# Altium schematic sheet 05_SiC_Nanosecond_Stage.SchDoc
size A4; SheetNumber: 5; SheetTotal: 6
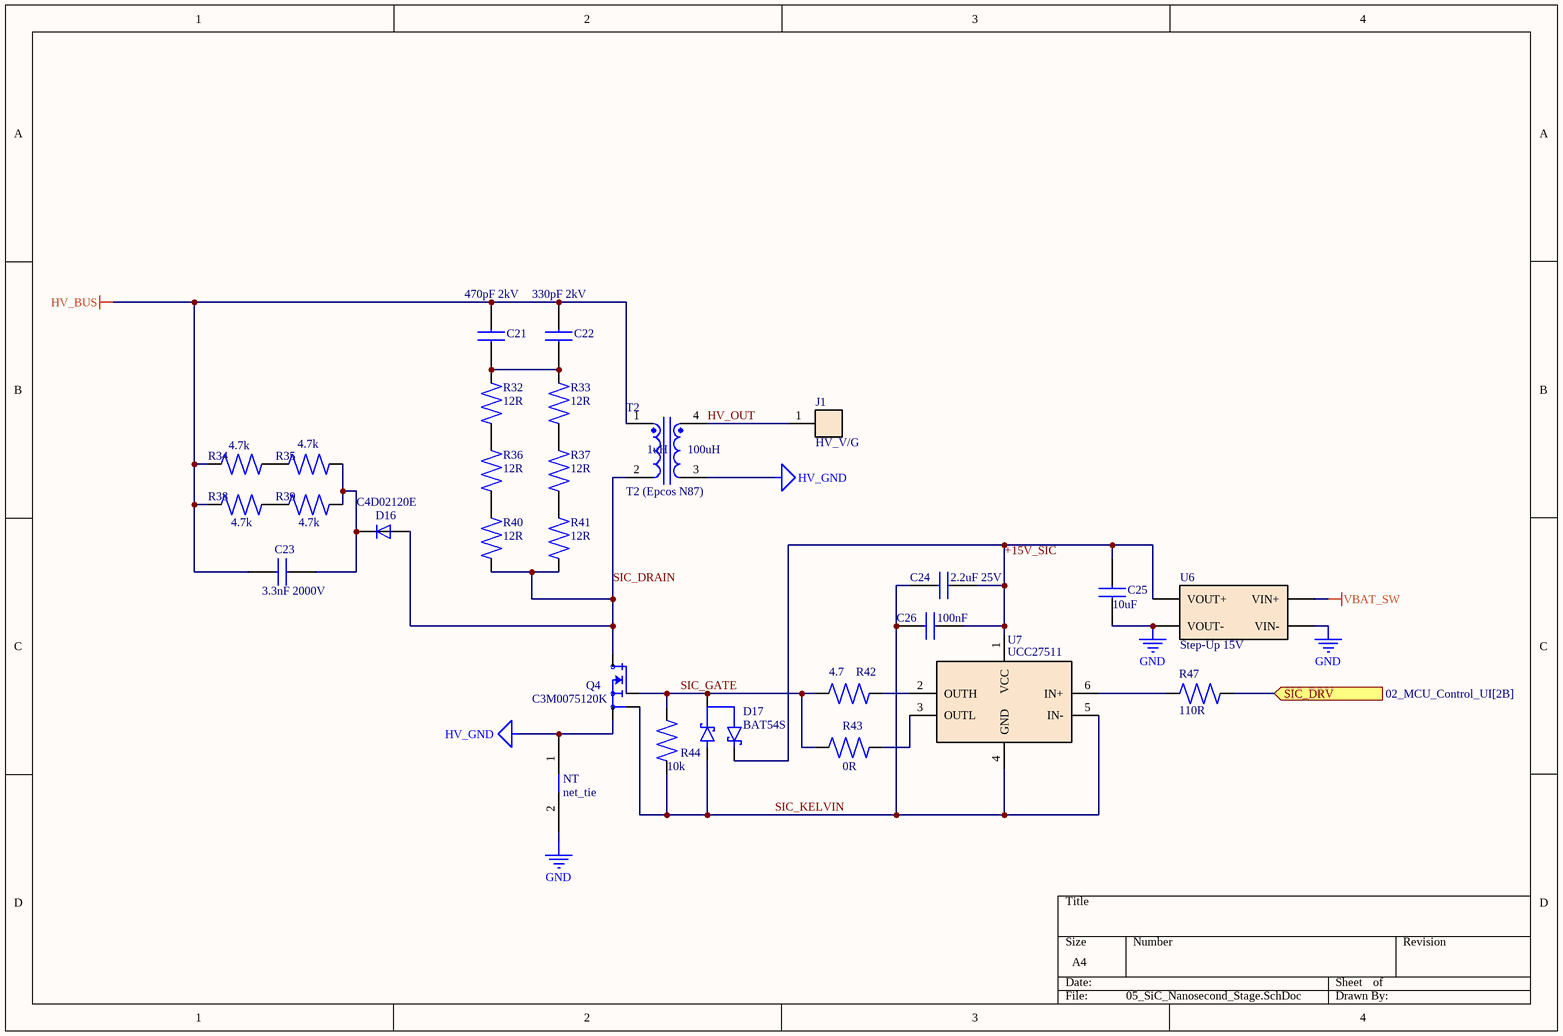
[diagram p0: 05_SiC_Nanosecond_Stage.SchDoc]

## Parts
C21  470pF 2kV  [CAP_FILM_P15.0_CBB81_HEAVY_DUTY]
C22  330pF 2kV  [CAP_FILM_P15.0_CBB81_HEAVY_DUTY]
C23  3.3nF 2000V  [CAP_FILM_P15.0_CBB81_HEAVY_DUTY]
C24  2.2uF 25V  [CHIP_0805_SMD]
C25  10uF  [CHIP_0805_SMD]
C26  100nF  [CHIP_0603_SMD]
D16  C4D02120E  [TO-252-2L_DPAK_THERMAL]
D17  BAT54S  [SOT-23_3P_SMD]
J1  HV_V/G  [PAD_HV_UL3239_28AWG_ROUND]
NT  net_tie  [NET_TIE_SMD]  (net tie, no BOM)
Q4  C3M0075120K  [TO-247-4_WOLFSPEED_SLOTTED_VERT]
R32  12R  [RES_2512_6.3x3.2_HANDSOLDER]
R33  12R  [RES_2512_6.3x3.2_HANDSOLDER]
R34  4.7k  [CHIP_1206_SMD]
R35  4.7k  [CHIP_1206_SMD]
R36  12R  [RES_2512_6.3x3.2_HANDSOLDER]
R37  12R  [RES_2512_6.3x3.2_HANDSOLDER]
R38  4.7k  [CHIP_1206_SMD]
R39  4.7k  [CHIP_1206_SMD]
R40  12R  [RES_2512_6.3x3.2_HANDSOLDER]
R41  12R  [RES_2512_6.3x3.2_HANDSOLDER]
R42  4.7  [CHIP_0603_SMD]
R43  0R  [CHIP_1206_SMD]
R44  10k  [CHIP_0603_SMD]
R47  110R  [CHIP_0805_SMD]
T2  T2 (Epcos N87)  [TRANS_AUTOTRANS_T2_EPCOS_R20_N87]
U6  Step-Up 15V  [MODULE_DC-DC_MT3608_BOOST_THT]
U7  UCC27511  [SOT-23-6_DBV_HANDSOLDER]

## Ports
SIC_DRV (in, see 02_MCU_Control_UI[2B])

## Nets
GND: C25.1 NT.2 U6.2(VIN-) U6.4(VOUT-)
HV_BUS: C21.2 C22.2 C23.1 R34.1 R38.1 T2.1(+850V)
HV_GND: NT.1 Q4.2(S) T2.3(HV_GND)
VBAT_SW: U6.1(VIN+)
+15V_SIC: C24.1 C25.2 C26.1 D17.2(K2) U6.3(VOUT+) U7.1(VCC)
HV_OUT: J1.1 T2.4(SEC+)
SIC_DRAIN: D16.1(A) Q4.1(D) R40.1 R41.1 T2.2(DRAIN)
SIC_DRV: R47.2 ; port SIC_DRV
SIC_GATE: D17.3(K1+A2) Q4.4(G) R42.1 R43.1 R44.2
SIC_KELVIN: C24.2 C26.2 D17.1(A1) Q4.3(KS) R44.1 U7.4(GND) U7.5(IN-)
NetC21_1: C21.1 C22.1 R32.2 R33.2
NetC23_2: C23.2 D16.2(K) R35.2 R39.2
NetR32_1: R32.1 R36.2
NetR33_1: R33.1 R37.2
NetR34_2: R34.2 R35.1
NetR36_1: R36.1 R40.2
NetR37_1: R37.1 R41.2
NetR38_2: R38.2 R39.1
NetR42_2: R42.2 U7.2(OUTH)
NetR43_2: R43.2 U7.3(OUTL)
NetR47_1: R47.1 U7.6(IN+)

## Notes on the sheet
- (in symbol TRANS_AUTOTRANS_T2_N87) 1uH; 100uH

## Library data of the parts
C21 = CAP_FILM_CBB81_470pF_2000V: Capacitor Film, Polypropylene (PP), 470 pF, 2000 VDC, ±5%, Radial THT, Pitch 15mm, CBB81
C22 = CAP_FILM_CBB81_330pF_2000V: Capacitor Film, Polypropylene (PP), 330 pF, 2000 VDC, ±5%, Radial THT, Pitch 15mm, CBB81
C23 = CAP_FILM_CBB81_3.2nF_2000V: Capacitor Film, Metallized Polypropylene (PP), 3.2 nF (3.3 nF), 2000 VDC (2 kV), ±5%, Radial THT, High Pulse / Resonant Tank, CBB81
C24 = CAP_0805_2.2uF_25V_X7R: Capacitor MLCC, Ceramic, 2.2 uF, 25 V, ±10%, X7R, SMD 0805, Hitano Enterprise
C25 = CAP_0805_10uF_16V_X7R: Capacitor MLCC, Ceramic, 10 uF, 16 V, ±10%, X7R, SMD 0805, Hitano Enterprise; Part Number:: 0805B106K160NT
C26 = CAP_0603_100nF_50V_X7R: Capacitor MLCC, Ceramic, 100 nF, 50 V, ±10%, X7R, SMD 0603, Samsung Electro-Mechanics; Part Number:: CL10B104KB8NNNC
D16 = DIODE_SIC_C4D02120E_TO252: SiC Schottky Diode, 1200V, 2A, Zero Recovery, TO-252-2 (DPAK), Pin 1: Anode, Pin 2: Cathode (Tab)
D17 = DIODE_SCHOTTKY_BAT54S_SOT23: Schottky Barrier Diode Pair, 30V 200mA, Dual Series Array, SOT-23 (Pin 1: A1, Pin 2: K2, Pin 3: Common)
J1 = PAD_HV_TERMINAL_1P: High Voltage Solder Pad / Wire Terminal, Single Pin THT, Hole D=1.8mm, Pad D=3.5mm
NT = NET_TIE_SMD
Q4 = MOSFET_N-CH_C3M0075120K_TO247-4: SiC Power MOSFET N-CH, 1200V, 30A, 75 mOhm, Kelvin Source, TO-247-4, Wolfspeed / Cree
R32 R33 R36 R37 R40 R41 = RES_2512_12R_1W_5%: Resistor, 12 Ohm, ±5%, 1W, 200V, SMD 2512, High Power Pulse Snubber, Thick Film, UniOhm / Yageo
R34 R35 R38 R39 = RES_1206_4.7k_1%: Resistor, 4.7 kOhm, ±1%, 0.25W (1/4W), 200V, SMD 1206, Thick Film, Hitano
R42 = RES_0603_4R7: Resistor, 4.7 Ohm, ±5%, 0.1W (1/10W), 50V, SMD 0603, Gate Drive Series, KOME
R43 = RES_1206_0R: just in case
R44 = RES_0603_10k_1%: Resistor, 10 kOhm, ±1%, 0.1W (1/10W), 75V, SMD 0603, Thick Film, Hitano
R47 = RES_0805_110R_0.1%: Resistor Thin Film, 110 Ohm, ±0.1%, 0.125W (1/8W), 150V, SMD 0805, High Precision Gate Resistor, Yageo
T2 = TRANS_AUTOTRANS_T2_N87: Pulse Autotransformer, Ferrite Ring Epcos B64290-L632-X87 (N87), Pri: Braid 3.0mm (1-2T), Sec: UL3239 28AWG (10-12T)
U6 = MODULE_DCDC_MT3608_STEP-UP: Miniature DC-DC Step-Up Boost Converter Module, Vin 2-24V, Vout Adj 5-28V (Preset to 15V), 2A Max, MT3608
U7 = IC_GATE_DRIVER_UCC27511DBVR: Single-Channel High-Speed Low-Side Gate Driver, 4A Source / 8A Sink, Split Outputs (OUTH/OUTL), 4.5V to 18V, SOT-23-6, Texas Instruments